# Altium schematic sheet MCU+IO.SchDoc: MCU
size A3; DrawnBy: Mogens Groth Nicolaisen; DocumentNumber: 3; SheetNumber: 3; SheetTotal: 7
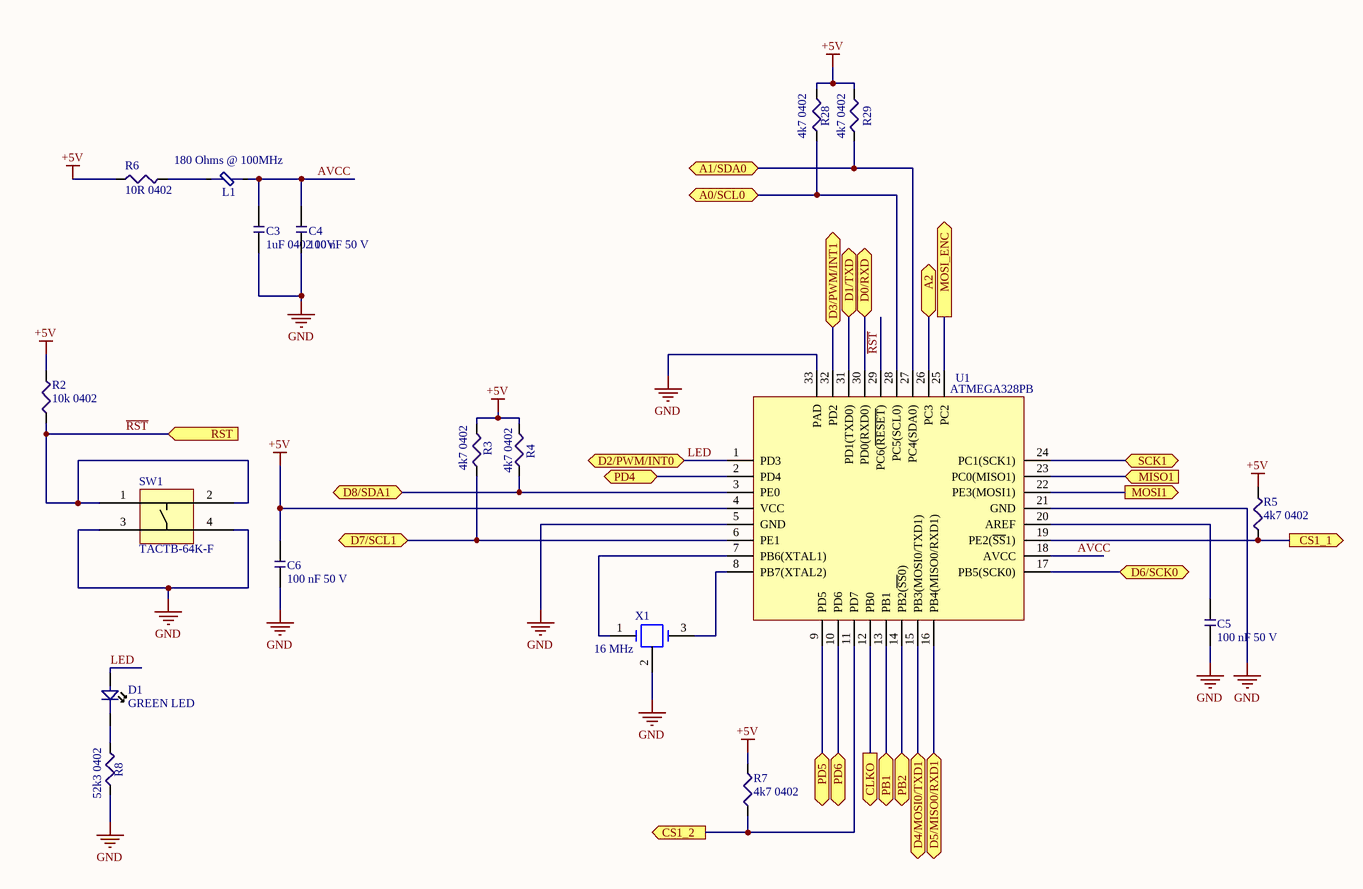
[diagram p0: MCU+IO.SchDoc]

## Parts
C3  1uF 0402 10V  [CAP_0402]
C4  100 nF 50 V  [CAP_0402]
C5  100 nF 50 V  [CAP_0402]
C6  100 nF 50 V  [CAP_0402]
D1  GREEN LED  [0402 LED]
L1  180 Ohms @ 100MHz  [IND_0603]
R2  10k 0402  [RES_0402]
R3  4k7 0402  [RES_0402]
R4  4k7 0402  [RES_0402]
R5  4k7 0402  [RES_0402]
R6  10R 0402  [RES_0402]
R7  4k7 0402  [RES_0402]
R8  52k3 0402  [RES_0402]
R28  4k7 0402  [RES_0402]
R29  4k7 0402  [RES_0402]
SW1  TACTB-64K-F  [TACTB-64K-F]
U1  ATMEGA328PB  [QFN50P500X500X90_HS-33N]
X1  16 MHz  [CSTCE16XTAL]

## Ports
A0/SCL0 (bidir), A1/SDA0 (bidir), A2 (bidir), CLKO (out), CS1_1 (out), CS1_2 (out), D0/RXD (bidir), D1/TXD (bidir), D2/PWM/INT0 (bidir), D3/PWM/INT1 (bidir), D4/MOSI0/TXD1 (bidir), D5/MISO0/RXD1 (bidir), D6/SCK0 (bidir), D7/SCL1 (bidir), D8/SDA1 (bidir), MISO1 (in), MOSI1 (out), MOSI_ENC (out), PB1 (bidir), PB2 (bidir), PD4 (bidir), PD5 (bidir), PD6 (bidir), RST (in), SCK1 (bidir)

## Nets
+5V: C6.1 R2.2 R3.2 R4.2 R5.2 R6.1 R7.2 R28.2 R29.2 U1.4(VCC)
GND: C3.1 C4.2 C5.2 C6.2 R8.1 SW1.3 SW1.4 U1.5(GND) U1.21(GND) U1.33(PAD) X1.2(GND)
~{RST}: R2.1 SW1.1 SW1.2 U1.29(PC6(~{RESET})) ; port RST
A0/SCL0: R28.1 U1.28(PC5(SCL0)) ; port A0/SCL0
A1/SDA0: R29.1 U1.27(PC4(SDA0)) ; port A1/SDA0
A2: U1.26(PC3) ; port A2
AVCC: C3.2 C4.1 L1.2 U1.18(AVCC)
CLKO: U1.12(PB0) ; port CLKO
CS1_1: R5.1 U1.19(PE2(~{SS}1)) ; port CS1_1
CS1_2: R7.1 U1.11(PD7) ; port CS1_2
D0/RXD: U1.30(PD0(RXD0)) ; port D0/RXD
D1/TXD: U1.31(PD1(TXD0)) ; port D1/TXD
D3/PWM/INT1: U1.32(PD2) ; port D3/PWM/INT1
D4/MOSI0/TXD1: U1.15(PB3(MOSI0/TXD1)) ; port D4/MOSI0/TXD1
D5/MISO0/RXD1: U1.16(PB4(MISO0/RXD1)) ; port D5/MISO0/RXD1
D6/SCK0: U1.17(PB5(SCK0)) ; port D6/SCK0
D7/SCL1: R3.1 U1.6(PE1) ; port D7/SCL1
D8/SDA1: R4.1 U1.3(PE0) ; port D8/SDA1
LED: D1.1 U1.1(PD3) ; port D2/PWM/INT0
MISO1: U1.23(PC0(MISO1)) ; port MISO1
MOSI1: U1.22(PE3(MOSI1)) ; port MOSI1
MOSI_ENC: U1.25(PC2) ; port MOSI_ENC
PB1: U1.13(PB1) ; port PB1
PB2: U1.14(PB2(~{SS}0)) ; port PB2
PD4: U1.2(PD4) ; port PD4
PD5: U1.9(PD5) ; port PD5
PD6: U1.10(PD6) ; port PD6
SCK1: U1.24(PC1(SCK1)) ; port SCK1
NetC5_1: C5.1 U1.20(AREF)
NetD1_2: D1.2 R8.2
NetL1_1: L1.1 R6.2
NetU1_7: U1.7(PB6(XTAL1)) X1.1(OSC1)
NetU1_8: U1.8(PB7(XTAL2)) X1.3(OSC2)

## Notes on the sheet
- ON Development
- Title:
- Size:
- A3
- Drawn By:
- Date:
- Sheet
- of
- Revision:

## Library data of the parts
C3 = CMP-00032-5: 1uF 0402 10V 10% X5R; Material: Ceramic; Tolerance: 10%; Value: 1 uF; Voltage: 10 V; Capacitance: 1uF; Case/Package: 0402; Case Code (Imperial): 0402; Case Code (Metric): 1005; Contact Plating: Tin; Depth: 0.5mm; Dielectric: X5R; Height: 0.5mm; Length: 1mm; Max Operating Temperature: 85°C; Min Operating Temperature: -55°C; Mount: Surface Mount; Package Quantity: 1; Packaging: Tape and Reel; Radiation Hardening: No; Thickness: 0.022inch; Voltage Rating: 10V; Width: 0.02inch
C4-C6 = CMP-00088-2: Multilayer Ceramic Capacitors MLCC - SMD/SMT .1uF 50Volts X7R +/-10% 0402 STD; Tolerance: 10%; Value: 100nF; Voltage: 50 V; Voltage Rating: 50V; Mount: Surface Mount; Case/Package: 0402; Case Code (Imperial): 0402; Case Code (Metric): 1005; Min Operating Temperature: -55°C; Max Operating Temperature: 125°C; Capacitance: 100nF; Voltage Rating (DC): 50V; Packaging: Tape and Reel; Package Quantity: 10000; Dielectric: X7R; Termination: SMD/SMT; Length: 0.039inch; Height: 0.5mm; Width: 0.5mm; Thickness: 0.022inch; Lead Free: Lead Free; Halogen Free: Halogen Free
D1 = CMP-008-0001-2: 0402 SMD LED; Mfg. Part Number: LTST-C281KGKT
L1 = CMP-ROOT-0005-2: FERRITE BEAD 180 OHM 0603 1LN; Mfg. Part Number: BLM18PG181SN1D; Current: 1.5A; Value: 180 Ohm; Case/Package: 0603
R2 = CMP-001-0019-3: RES SMD 10K OHM 1% 1/16W 0402; Mfg. Part Number: RMCF0402FT10K0; Case/Package: 0402; Power: 1/16 W; Tolerance: 1 %; Value: 10k
R3-R5 R7 R28 R29 = CMP-001-0029-3: RES SMD 4.7K OHM 1% 1/16W 0402; Mfg. Part Number: RC1005F472CS; Tolerance: 1; Case/Package: 0402; Power: 1/16W; Value: 4k7
R6 = CMP-001-0033-3: RES SMD 10 OHM 1% 1/16W 0402; Mfg. Part Number: 0402WGF100JTCE; Power: 63mW; Case/Package: 0402; Tolerance: 1%; Value: 10R
R8 = CMP-001-0018-3: RES SMD 52.3K OHM 1% 1/16W 0402; Mfg. Part Number: RC0402FR-0752K3L; Case/Package: 0402; Power: 1/16 W; Tolerance: 1 %; Value: 52k3
SW1 = CMP-013-0002-1: Microswitch TACT; SPST-NO; Positions:2; 0.05A/12VDC;; Case/Package: -; Mount: SMD; Pins: 4; RoHS: Yes; Mfg. Part No.: TACTB-64K-F
U1 = CMP-011-0001-4: IC MCU 8BIT 32KB FLASH 32TQFP; Case/Package: QFN-32; Mount: SMD; Pins: 32; RoHS: Yes
X1 = CMP-015-0002-4: CER RES 16.0000MHZ 15PF SMD; Mfg. Part Number: CSTCE16M0V53-R0; FootprintName1: CSTCE16XTAL; FootprintDescription1: CSTCE16M0V53-R0; FootprintRevisionID1: PCC-0038-1; Case/Package: -; Mount: SMD; Pins: 3; RoHS: Yes